# EAGLE schematic Sensor PCB backup (EAGLE 9.2.2)
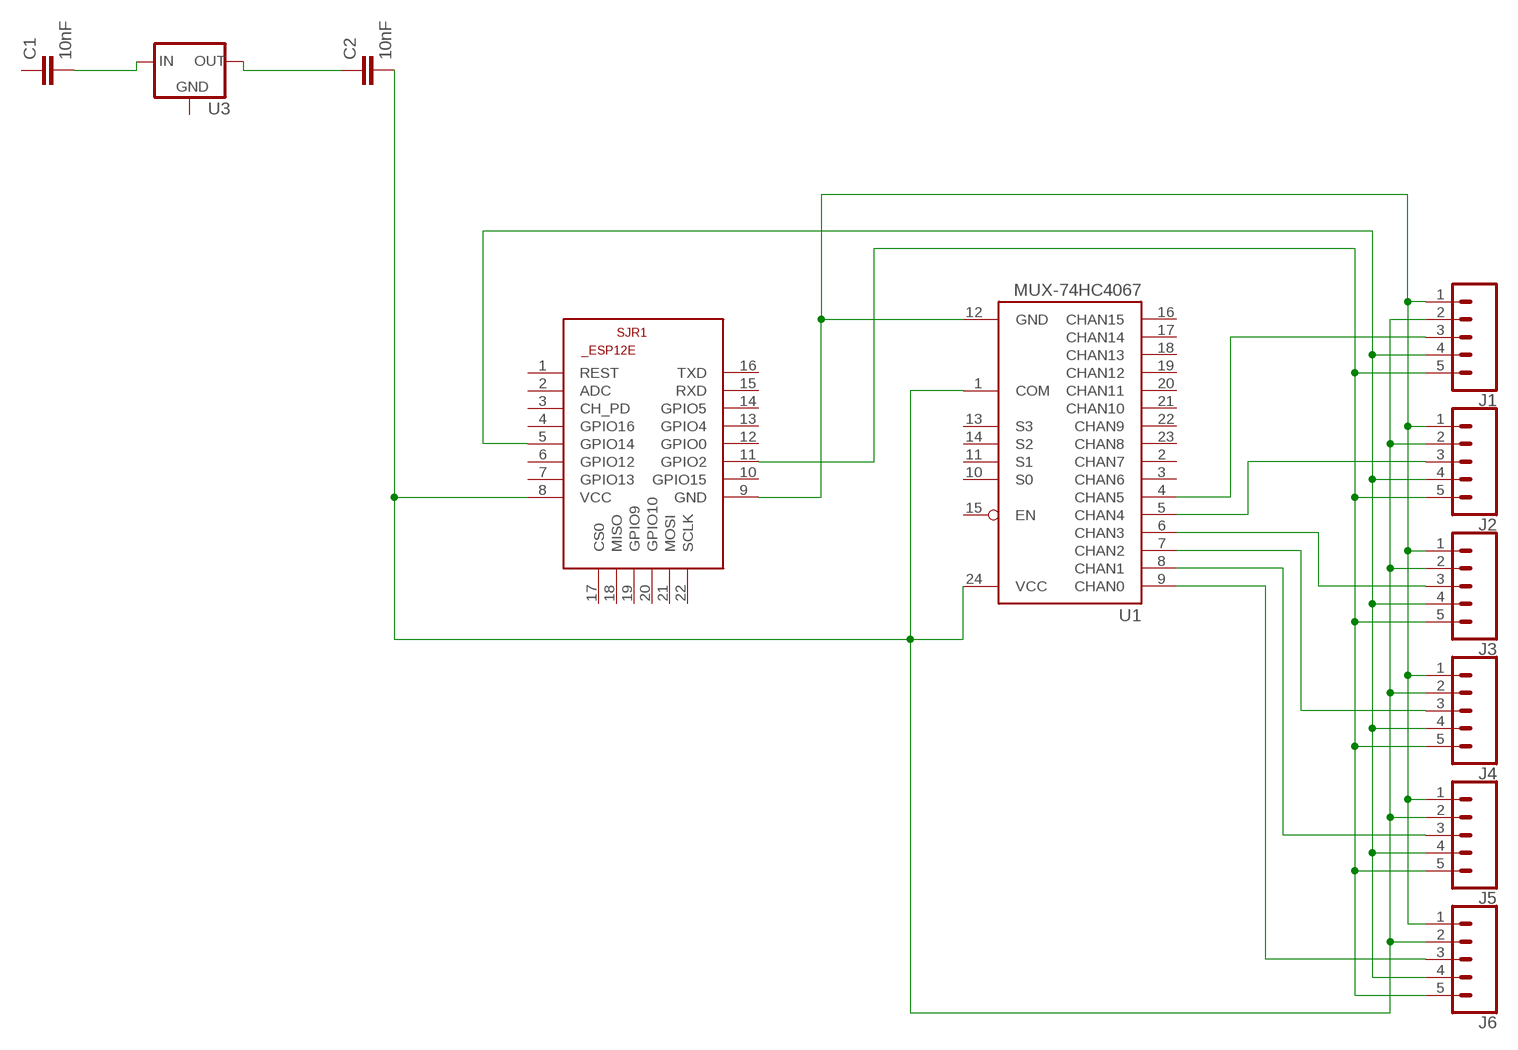
[diagram p0: schematic, sheet 1]

## Parts
C1  10nF  10NF-0603-50V-10%  [0603]
C2  10nF  10NF-0603-50V-10%  [0603]
J1  CONN_05SMD  [1X05_1MM]
J2  CONN_05SMD  [1X05_1MM]
J3  CONN_05SMD  [1X05_1MM]
J4  CONN_05SMD  [1X05_1MM]
J5  CONN_05SMD  [1X05_1MM]
J6  CONN_05SMD  [1X05_1MM]
SJR1  ESP8266-12EESP12E  [ESP8266-ESP12E]
U1  MUX-74HC4067  MUX-74HC4067SMD  [SSOP24]
U3  V_REG_78XX-TO-220  [TO-220-ALT]

## Nets
N$1: C1.2 U3.IN
N$2: C2.1 U3.OUT
N$3: C2.2 J1.2 J2.2 J3.2 J4.2 J5.2 J6.2 SJR1.8(VCC) U1.1(COM) U1.24(VCC)
N$4: J3.3 U1.6(CHAN3)
N$5: J1.3 U1.4(CHAN5)
N$6: J2.3 U1.5(CHAN4)
N$8: J4.3 U1.7(CHAN2)
N$9: J5.3 U1.8(CHAN1)
N$10: J6.3 U1.9(CHAN0)
N$11: J1.5 J2.5 J3.5 J4.5 J5.5 J6.5 SJR1.11(GPIO2)
N$12: J1.4 J2.4 J3.4 J4.4 J5.4 J6.4 SJR1.5(GPIO14)
N$13: J1.1 J2.1 J3.1 J4.1 J5.1 J6.1 SJR1.9(GND) U1.12(GND)
Unconnected: C1.1 SJR1.1(REST) SJR1.2(ADC) SJR1.3(CH_PD) SJR1.4(GPIO16) SJR1.6(GPIO12) SJR1.7(GPIO13) SJR1.10(GPIO15) SJR1.12(GPIO0) SJR1.13(GPIO4) SJR1.14(GPIO5) SJR1.15(RXD) SJR1.16(TXD) SJR1.17(CS0) SJR1.18(MISO) SJR1.19(GPIO9) SJR1.20(GPIO10) SJR1.21(MOSI) SJR1.22(SCLK) U1.2(CHAN7) U1.3(CHAN6) U1.10(S0) U1.11(S1) U1.13(S3) U1.14(S2) U1.15(EN) U1.16(CHAN15) U1.17(CHAN14) U1.18(CHAN13) U1.19(CHAN12) U1.20(CHAN11) U1.21(CHAN10) U1.22(CHAN9) U1.23(CHAN8) U3.GND

## Library data of the parts
C1 C2 = SparkFun-Capacitors:10NF: 0.01uF/10nF/10,000pF ceramic capacitors A capacitor is a passive two-terminal electrical component used to store electrical energy temporarily in an electric field. CAP-09321; PROD_ID: CAP-00867
J1-J6 = SparkFun-Connectors:CONN_05: Multi connection point. Often used as Generic Header-pin footprint for 0.1 inch spaced/style header connections On any of the 0.1 inch spaced packages, you can populate with these: Break Away Headers - Straight <https://www.sparkfun.com/products/116> (PRT-00116) Break Away Male Headers - Right Angle <https://www.sparkfun.com/products/553> (PRT-00553) Female Headers <https://www.sparkfun.com/products/115> (PRT-00115) Break Away Headers - Machine Pin <https://www.sparkfun.com/products/117> (PRT-00117) Break Away Female Headers - Swiss Machine Pin <https://www.sparkfun.com/products/743> (PRT-00743) For SCREWTERMINALS and SPRING TERMINALS visit here: Screw Terimnals on SparkFun.com <https://www.sparkfun.com/search/results?term=Screw+Terminals> (5mm/3.5mm/2.54mm spacing) This device is also useful as a general connection point to wire up your design to another part of your project. Our various solder wires solder well into these plated through hole pads. Hook-Up Wire - Assortment (Stranded, 22 AWG) <https://www.sparkfun.com/products/11375> (PRT-11375) Hook-Up Wire - Assortment (Solid Core, 22 AWG) <https://www.sparkfun.com/products/11367> (PRT-11367) View the entire wire category on our website here <https://www.sparkfun.com/categories/141> Special notes: Molex polarized connector foot print use with SKU : PRT-08231 with associated crimp pins and housings. 1MM SMD Version SKU: PRT-10208; PROD_ID: CONN-08528; SF_ID: GPS-08288
SJR1 = esp12e:ESP8266-12E: ESP8266-12E Library for Eagle CAD The author not responsible for any damages or errors!. Created by Suhail jr.lt;/author>
U1 = SparkFun:MUX-74HC4067
U3 = SparkFun-IC-Power:V_REG_78XX: Voltage Regulator Standard 78xx regulator. IGO (Input Ground Output). Spark Fun Electronics SKU : COM-00107; PROD_ID: VREG-08450; SF_ID: COM-00107